# EasyEDA Pro project pre_pcb_new pcb design.eprj

# Schematic Schematic1
Board Name: Board1; Create Date: 2024-11-25; Page Name: P1; Project Name: new pcb design; Schematic Name: Schematic1; Update Date: 2024-11-26; Company: EasyEDA.com; Page Size: A4; Version: V2.0
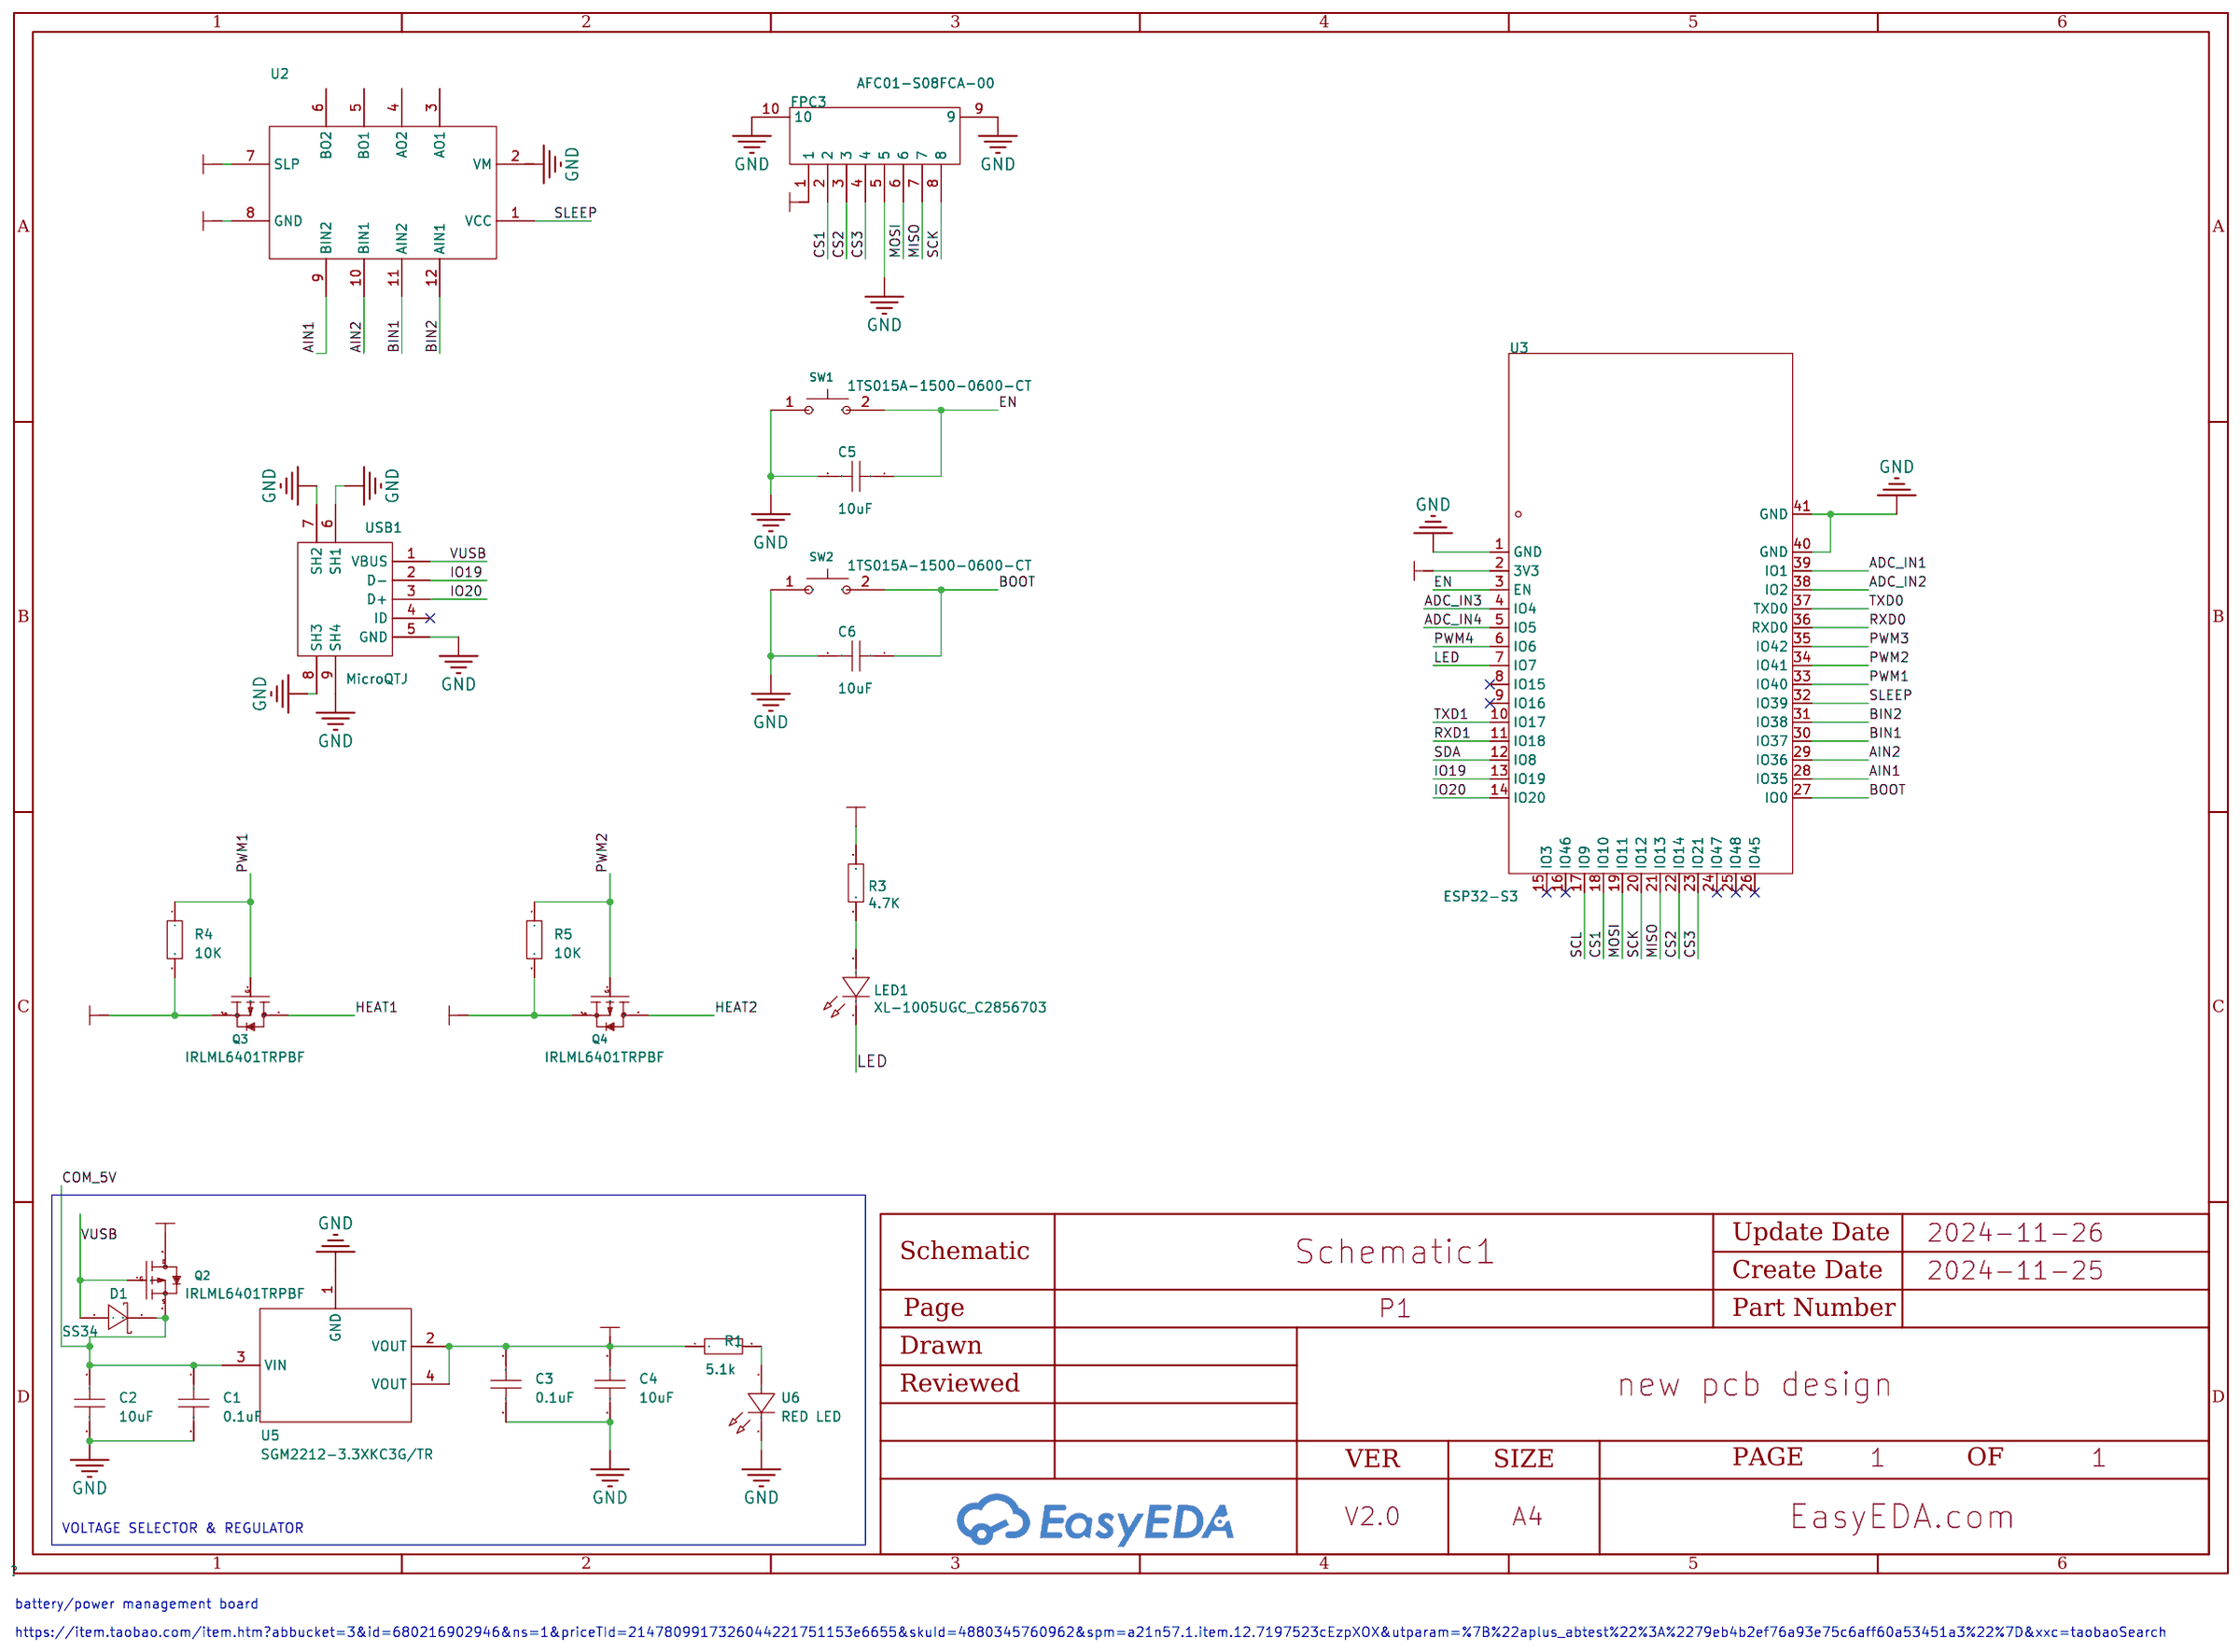
[diagram p0: schematic sheet]

## Parts
C1  0.1uF  [C0603]
C2  10uF  [C0603]
C3  0.1uF  [C0603]
C4  10uF  [C0603]
C5  10uF  [C0603]
C6  10uF  [C0603]
D1  SS34  [SMC_L6.9-W5.9-LS7.9-RD]
FPC3  AFC01-S08FCA-00  [FPC-SMD_P0.50-8P_FGS-XJ-H2.0]
LED1  XL-1005UGC_C2856703  [LED0402-RD_GREEN]
Q2  IRLML6401TRPBF  [SOT-23-3_L2.9-W1.3-P1.90-LS2.4-BR]
Q3  IRLML6401TRPBF  [SOT-23-3_L2.9-W1.3-P1.90-LS2.4-BR]
Q4  IRLML6401TRPBF  [SOT-23-3_L2.9-W1.3-P1.90-LS2.4-BR]
R1  5.1k  [R0603]
R3  4.7K  [R0402]
R4  10K  [R0603]
R5  10K  [R0603]
SW1  1TS015A-1500-0600-CT  [SW-SMD_L3.0-W2.0-LS3.5]
SW2  1TS015A-1500-0600-CT  [SW-SMD_L3.0-W2.0-LS3.5]
U2  -  [DOUBLE_DRV8210]
U3  ESP32-S3  [WIRELM-SMD_ESP32-S3-WROOM-1]
U5  SGM2212-3.3XKC3G/TR  [SOT-223-4_L6.5-W3.5-P2.30-LS7.0-BR]
U6  RED LED  [LED0402-R-RD]
USB1  MicroQTJ  [MICRO-USB-SMD_MICROQTJ-5P]

## Library data of the parts
C1-C6 = CAP_0603: Supplier Footprint: 0603
D1 = SS34_C169162: LCSC Part Name: 电压:40V 电流:3A; Supplier Part: C169162; Supplier Footprint: SMC(DO-214AB); JLCPCB Part Class: Extended Part; Datasheet: https://atta.szlcsc.com/upload/public/pdf/source/20180130/C169162_15172974043501323414.pdf; Supplier: LCSC; Forward Voltage (Vf@If): 500mV@3A; Reverse Voltage (Vr): 40V; Average Rectified Current (Io): 3A
FPC3 = AFC01-S08FCA-00: LCSC Part Name: 间距:0.5mm P数:8P 翻盖式 下接; Supplier Part: C262657; Manufacturer: JS(钜硕电子); Supplier Footprint: SMD,P=0.5mm,卧贴; JLCPCB Part Class: Extended Part; Datasheet: https://atta.szlcsc.com/upload/public/pdf/source/20190816/C413942_2A72D1AC756EAE17EEDF756A339D4500.pdf; Supplier: LCSC; Locking Feature: Clamshell; Contact Type: Bottom Contact; Number of Contacts: 8P; Pitch: 0.5mm; Mounting Type: 卧贴; FFC, FCB Thickness: 0.3mm; Height Above Board: 2mm
LED1 = XL-1005UGC_C2856703: link: https://so.szlcsc.com/global.html?k=C2856703&amp;ref=editor; 3DModel: LED0402_L1.0-W0.5-H0.2; Supplier: LCSC; Supplier Part: C2856703; Manufacturer: XINGLIGHT(成兴光); Manufacturer Part: XL-1005UGC; JLCPCB Part Class: Extended Part
Q2-Q4 = IRLML6401TRPBF_C5182042: Supplier Part: C5182042; Manufacturer: TECH PUBLIC(台舟); Supplier Footprint: SOT-23; Datasheet: https://atta.szlcsc.com/upload/public/pdf/source/20220927/F94DD8E07BE7777460EDDF0B320F674D.pdf; Supplier: LCSC
R1 R4 R5 = Res_0603: Supplier Footprint: 0603
R3 = 4.7K: link: https://so.szlcsc.com/global.html?k=C60490&amp;ref=editor; 3DModel: R0402_L1.0-W0.5-H0.5; Supplier: LCSC; Manufacturer: YAGEO(国巨); Manufacturer Part: RC0402FR-0710KL; Supplier Part: C60490; JLCPCB Part Class: Extended Part
SW1 SW2 = 1TS015A-1500-0600-CT: LCSC Part Name: 3*2*0.6mm 立贴 轻触开关; Supplier Part: C319434; Manufacturer: HYP(鸿源精密); Supplier Footprint: SMD,2x3mm; JLCPCB Part Class: Extended Part; Datasheet: https://atta.szlcsc.com/upload/public/pdf/source/20181106/C319434_B3AA23CF9D2B2E70128718BA7D32871A.pdf; Supplier: LCSC; Circuit: SPST; Actuator Style: Round Button; Operating Force: 150gf; Mounting Style: Brick nogging; Switch Length: 3mm; Switch Width: 2mm; Switch Height: 0.6mm; Strike Gundam: 不带; Contact Current: 50mA; Voltage Rating (DC): 12V; Power Rating: 0.6W; Insulation Resistance: 100MΩ; Actuator/Cap Color: Black; With Lamp: No; IP Rating: IP68; Pin Style: SMDSplicing; Mechanical Life: 30万次; Operating Temperature: -40℃~+90℃
U2 = DOUBLE_DRV8210
U3 = ESP32-S3-WROOM-1-N8R2: LCSC Part Name: 通用型Wi-Fi+低功耗蓝牙MCU模组; Supplier Part: C2913204; Manufacturer: ESPRESSIF(乐鑫); Supplier Footprint: SMD,18x25.5mm; JLCPCB Part Class: Extended Part; Datasheet: https://atta.szlcsc.com/upload/public/pdf/source/20241030/6A412B13087E1327DF6279F5735253CA.pdf; Supplier: LCSC; Core Processor: ESP32-S3 Chip; Support Interface: I2C；GPIO；SPI；PWM；ADC；UART；USB；I2S
U5 = SGM2212-3.3XKC3G/TR: Supplier Part: C9900018517; Supplier Footprint: SOT-223-4; Supplier: LCSC
U6 = YLED0402G: LCSC Part Name: 发光管; Supplier Part: C20608784; Manufacturer: YONGYUTAI(永裕泰); Supplier Footprint: 0402; JLCPCB Part Class: Extended Part; Datasheet: https://atta.szlcsc.com/upload/public/pdf/source/20240119/2792316D86947EC95655E09EC4742546.pdf; Supplier: LCSC
USB1 = MicroQTJ: LCSC Part Name: Micro-B 母 卧贴; Supplier Part: C404968; Manufacturer: SHOU HAN(首韩); Supplier Footprint: SMD; JLCPCB Part Class: Extended Part; Datasheet: https://atta.szlcsc.com/upload/public/pdf/source/20191210/C404968_B20FD489995C34B84F95A25A4974802C.pdf; Supplier: LCSC; Connector Type: Micro-B; Standard: USB 2.0; Gender: Female; Mounting Style: Horizontal attachment; Number of Contacts: 5P; Number of Ports: 1; Operating Temperature Range: -30℃~+80℃; Connect-Disconnect Life: 3000 times; Core Colour: Black

## Nets
3V3: R3.1
GND: C1.2 C2.2 C3.1 C4.1 C5.2 C6.2 FPC3.5 FPC3.9 FPC3.10 SW1.1 SW2.1 U2.2(VM) U3.1(GND) U3.40(GND) U3.41(GND) U5.1(GND) U6.2(K) USB1.5(GND) USB1.6(SH1) USB1.7(SH2) USB1.8(SH3) USB1.9(SH4)
VBAT: Q2.3(D)
VCC_3V3: C3.2 C4.2 FPC3.1 R1.1 U2.7(SLP) U3.2(3V3) U5.2(VOUT) U5.4(VOUT)
ADC_IN1: U3.39(IO1)
ADC_IN2: U3.38(IO2)
ADC_IN3: U3.4(IO4)
ADC_IN4: U3.5(IO5)
AIN1: U2.9(BIN2) U3.28(IO35)
AIN2: U2.10(BIN1) U3.29(IO36)
BIN1: U2.11(AIN2) U3.30(IO37)
BIN2: U2.12(AIN1) U3.31(IO38)
BOOT: C6.1 SW2.2 U3.27(IO0)
COM_5V: C1.1 C2.1 D1.1(C) Q2.2(S) U5.3(VIN)
CS1: FPC3.2 U3.18(IO10)
CS2: FPC3.3 U3.22(IO14)
CS3: FPC3.4 U3.23(IO21)
EN: C5.1 SW1.2 U3.3(EN)
HEAT1: Q3.3(D)
HEAT2: Q4.3(D)
IO19: U3.13(IO19) USB1.2(D-)
IO20: U3.14(IO20) USB1.3(D+)
LED: LED1.1(K) U3.7(IO7)
MISO: FPC3.7 U3.21(IO13)
MOSI: FPC3.6 U3.19(IO11)
PWM1: Q3.1(G) R4.1 U3.33(IO40)
PWM2: Q4.1(G) R5.1 U3.34(IO41)
PWM3: U3.35(IO42)
PWM4: U3.6(IO6)
RXD0: U3.36(RXD0)
RXD1: U3.11(IO18)
SCK: FPC3.8 U3.20(IO12)
SCL: U3.17(IO9)
SDA: U3.12(IO8)
SLEEP: U2.1(VCC) U3.32(IO39)
TXD0: U3.37(TXD0)
TXD1: U3.10(IO17)
VM: Q3.2(S) Q4.2(S) R4.2 R5.2 U2.8(GND)
VUSB: D1.2(A) Q2.1(G) USB1.1(VBUS)
Net-(LED1-2): LED1.2(A) R3.2
Net-(R1-2): R1.2 U6.1(A)

Not connected (* = marked no-connect by the designer): U2 3(AO1) 4(AO2) 5(BO1) 6(BO2); U3 8(IO15)* 9(IO16)* 15(IO3)* 16(IO46)* 24(IO47)* 25(IO48)* 26(IO45)*; USB1 4(ID)*

## Notes on the sheet
- VOLTAGE SELECTOR & REGULATOR
- battery/power management board
- https://item.taobao.com/item.htm?abbucket=3&id=680216902946&ns=1&priceTId=2147809917326044221751153e6655&skuId=4880345760962&spm=a21n57.1.item.12.7197523cEzpXOX&utparam=%7B%22aplus_abtest%22%3A%2279eb4b2ef76a93e75c6aff60a53451a3%22%7D&xxc=taobaoSearch
